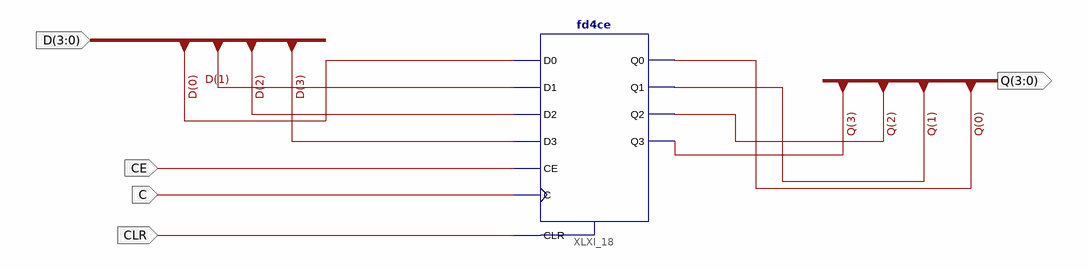
[diagram p0: schematic sheet 1]
// Xilinx ISE schematic FD4CEBus.sch (spartan3e) as structural Verilog: 1 symbols, 5 ports
module FD4CEBus (
  input  [3:0] D,
  input  CE,
  input  C,
  input  CLR,
  output [3:0] Q
);

  fd4ce XLXI_18 (
    .C(C), .CE(CE), .CLR(CLR), .D0(D[0]), .D1(D[1]), .D2(D[2]), .D3(D[3]), .Q0(Q[0]), .Q1(Q[1]), .Q2(Q[2]),
    .Q3(Q[3]));
endmodule
